# EAGLE schematic Mini12 (EAGLE 6.5.0)

## Sheet 1 of 3: Amplifier
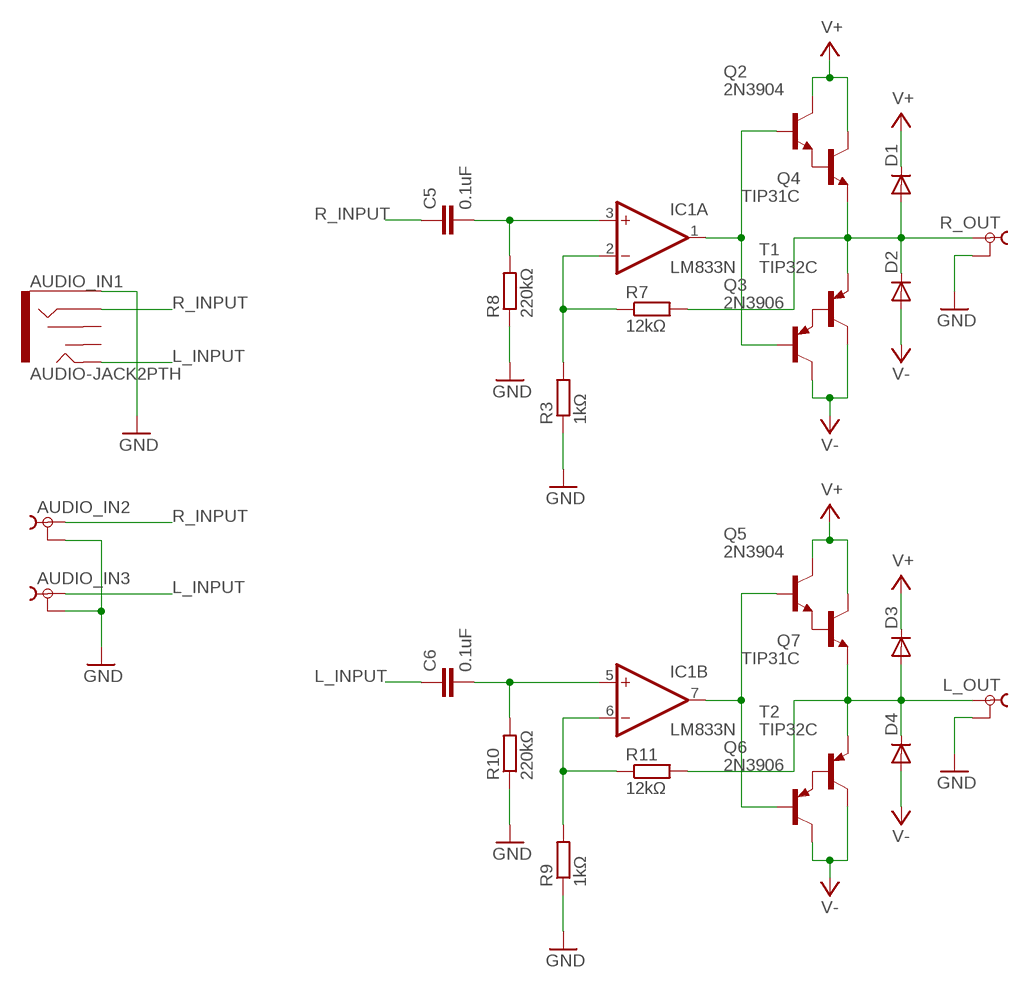
[diagram p0: schematic, sheet 1]

### Parts
AUDIO_IN1  AUDIO-JACK2PTH  [AUDIO-JACK]
AUDIO_IN2  TOBU3  [TOBU3]
AUDIO_IN3  TOBU3  [TOBU3]
C5  0.1uF  C-EU025-025X050  [C025-025X050]
C6  0.1uF  C-EU025-025X050  [C025-025X050]
D1  1N4148DO35-7  [DO35-7]
D2  1N4148DO35-7  [DO35-7]
D3  1N4148DO35-7  [DO35-7]
D4  1N4148DO35-7  [DO35-7]
IC1  LM833N  [DIL08]
L_OUT  TOBU3  [TOBU3]
Q2  2N3904  [TO92]
Q3  2N3906  [TO92]
Q4  TIP31C  [TO220]
Q5  2N3904  [TO92]
Q6  2N3906  [TO92]
Q7  TIP31C  [TO220]
R3  1kΩ  R-EU_0207/10  [0207/10]
R7  12kΩ  R-EU_0207/10  [0207/10]
R8  220kΩ  R-EU_0207/10  [0207/10]
R9  1kΩ  R-EU_0207/10  [0207/10]
R10  220kΩ  R-EU_0207/10  [0207/10]
R11  12kΩ  R-EU_0207/10  [0207/10]
R_OUT  TOBU3  [TOBU3]
T1  TIP32C  [TO220]
T2  TIP32C  [TO220]

### Nets
GND: AUDIO_IN1.SLEEVE AUDIO_IN2.2 AUDIO_IN2.2@1 AUDIO_IN2.2@2 AUDIO_IN3.2 AUDIO_IN3.2@1 AUDIO_IN3.2@2 L_OUT.2 L_OUT.2@1 L_OUT.2@2 R3.1 R8.1 R9.1 R10.1 R_OUT.2 R_OUT.2@1 R_OUT.2@2 ; also sheet 2,3
L_INPUT: AUDIO_IN1.TIP AUDIO_IN3.1 C6.1
N$2: IC1.2(A:-IN) R3.2 R7.1
N$3: C5.2 IC1.3(A:+IN) R8.2
N$5: IC1.6(B:-IN) R9.2 R11.1
N$6: C6.2 IC1.5(B:+IN) R10.2
N$24: Q2.3(E) Q4.1(B)
N$25: Q3.3(E) T1.1(B)
N$26: D1.A D2.C Q4.3(E) R7.2 R_OUT.1 T1.3(E)
N$27: IC1.1(A:OUT) Q2.2(B) Q3.2(B)
N$31: Q5.3(E) Q7.1(B)
N$32: Q6.3(E) T2.1(B)
N$33: D3.A D4.C L_OUT.1 Q7.3(E) R11.2 T2.3(E)
N$34: IC1.7(B:OUT) Q5.2(B) Q6.2(B)
R_INPUT: AUDIO_IN1.RING AUDIO_IN2.1 C5.1
V+: D1.C D3.C Q2.1(C) Q4.2(C) Q5.1(C) Q7.2(C) ; also sheet 2,3
V-: D2.A D4.A Q3.1(C) Q6.1(C) T1.2(C) T2.2(C) ; also sheet 2,3
Unconnected: AUDIO_IN1.RSH AUDIO_IN1.TSH

## Sheet 2 of 3: Power Supply
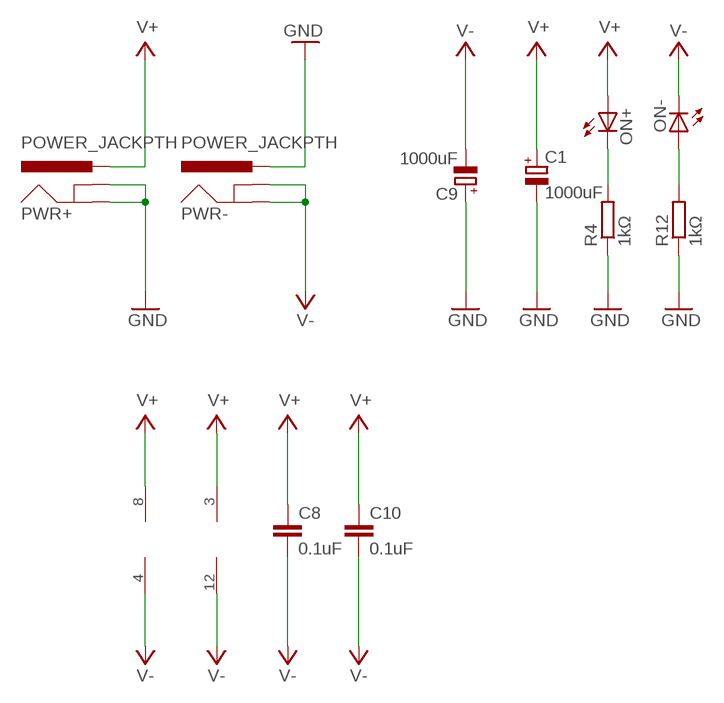
[diagram p1: schematic, sheet 2]

### Parts
C1  1000uF  CPOL-EUE2.5-6  [E2,5-6]
C8  0.1uF  C-EU025-025X050  [C025-025X050]
C9  1000uF  CPOL-EUE2.5-6  [E2,5-6]
C10  0.1uF  C-EU025-025X050  [C025-025X050]
IC2  LM339N  [DIL14]
ON+  LEDSQR2X5  [LED2X5]
ON-  LEDSQR2X5  [LED2X5]
PWR+  POWER_JACKPTH  [POWER_JACK_PTH]
PWR-  POWER_JACKPTH  [POWER_JACK_PTH]
R4  1kΩ  R-EU_0207/10  [0207/10]
R12  1kΩ  R-EU_0207/10  [0207/10]

### Nets
GND: C1.- C9.+ PWR+.GND PWR+.GNDBREAK PWR-.PWR R4.1 R12.1 ; also sheet 1,3
N$7: ON-.A R12.2
N$22: ON+.K(C) R4.2
V+: C1.+ C8.1 C10.1 IC1.8(P:V+) IC2.3(P:V+) ON+.A PWR+.PWR ; also sheet 1,3
V-: C8.2 C9.- C10.2 IC1.4(P:V-) IC2.12(P:GND) ON-.K(C) PWR-.GND PWR-.GNDBREAK ; also sheet 1,3

## Sheet 3 of 3: Clipping/Overload Detector
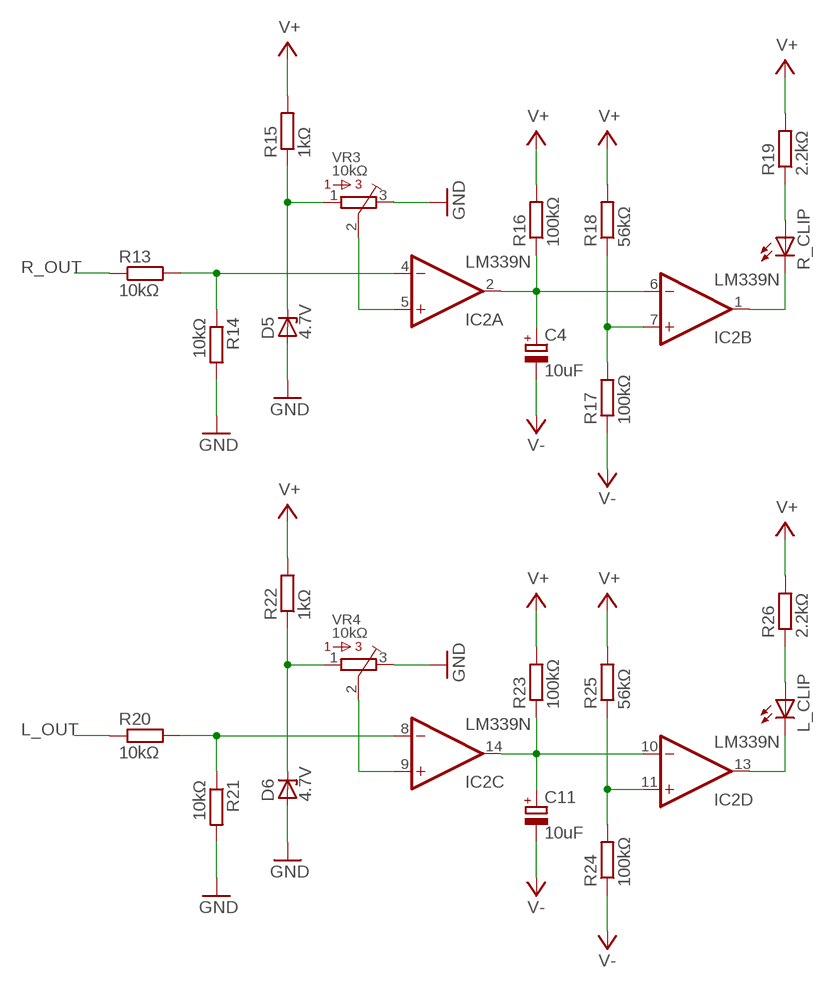
[diagram p2: schematic, sheet 3]

### Parts
C4  10uF  CPOL-EUE2.5-6  [E2,5-6]
C11  10uF  CPOL-EUE2.5-6  [E2,5-6]
D5  4.7V  ZENER-DIODEDO34-7  [DO34Z7]
D6  4.7V  ZENER-DIODEDO34-7  [DO34Z7]
L_CLIP  LED5MM  [LED5MM]
R13  10kΩ  R-EU_0207/10  [0207/10]
R14  10kΩ  R-EU_0207/10  [0207/10]
R15  1kΩ  R-EU_0207/10  [0207/10]
R16  100kΩ  R-EU_0207/10  [0207/10]
R17  100kΩ  R-EU_0207/10  [0207/10]
R18  56kΩ  R-EU_0207/10  [0207/10]
R19  2.2kΩ  R-EU_0207/10  [0207/10]
R20  10kΩ  R-EU_0207/10  [0207/10]
R21  10kΩ  R-EU_0207/10  [0207/10]
R22  1kΩ  R-EU_0207/10  [0207/10]
R23  100kΩ  R-EU_0207/10  [0207/10]
R24  100kΩ  R-EU_0207/10  [0207/10]
R25  56kΩ  R-EU_0207/10  [0207/10]
R26  2.2kΩ  R-EU_0207/10  [0207/10]
R_CLIP  LED5MM  [LED5MM]
VR3  10kΩ  3362U  [3362U]
VR4  10kΩ  3362U  [3362U]

### Nets
GND: D5.A D6.A R14.2 R21.2 VR3.3 VR4.3 ; also sheet 1,2
L_OUT: R20.1
N$9: IC2.4(A:-IN) R13.2 R14.1
N$10: IC2.5(A:+IN) VR3.2
N$11: D5.C R15.1 VR3.1
N$12: C4.+ IC2.2(A:OUT) IC2.6(B:-IN) R16.1
N$13: IC2.7(B:+IN) R17.2 R18.1
N$14: IC2.1(B:OUT) R_CLIP.K(C)
N$15: R19.1 R_CLIP.A
N$16: IC2.8(C:-IN) R20.2 R21.1
N$17: IC2.9(C:+IN) VR4.2
N$18: D6.C R22.1 VR4.1
N$19: C11.+ IC2.10(D:-IN) IC2.14(C:OUT) R23.1
N$20: IC2.11(D:+IN) R24.2 R25.1
N$21: IC2.13(D:OUT) L_CLIP.K(C)
N$23: L_CLIP.A R26.1
R_OUT: R13.1
V+: R15.2 R16.2 R18.2 R19.2 R22.2 R23.2 R25.2 R26.2 ; also sheet 1,2
V-: C4.- C11.- R17.1 R24.1 ; also sheet 1,2

## Library data of the parts
AUDIO_IN1 = SparkFun-Connectors:AUDIO-JACK2: Stereo audio jack with bypass switches.
AUDIO_IN2 AUDIO_IN3 L_OUT R_OUT = con-hirschmann:TOBU3: Female Cinch CONNECTOR ( RCA Jack ); MF: FARNELL; MPN: TOBU 3; OC_FARNELL: 592791; OC_NEWARK: 06WX5914
C1 C4 C9 C11 = rcl:CPOL-EU: POLARIZED CAPACITOR, European symbol
C5 C6 C8 C10 = rcl:C-EU: CAPACITOR, European symbol
D1-D4 = diode:1N4148: DIODE high speed (Philips)
D5 D6 = diode:ZENER-DIODE: Z-Diode
IC1 = linear:LM833: OP AMP
IC2 = linear:LM339: Low Power Low Offset Voltage Quad Comparators with open collector; LM139/LM239/LM339/LM2901/LM3302
L_CLIP R_CLIP = adafruit:LED: LED
ON+ ON- = led:LED: LED
PWR+ PWR- = SparkFun-Connectors:POWER_JACK: Power Jack This is the standard 5.5mm barrel jack for power. The PTH is the most common, proven, reliable, footprint. The Slot footprint only works if the mill layer is transmitted to the PCB fab house so be warned. Spark Fun Electronics SKU : PRT-00119 SMT: CONN-08106 Mating wall wart : TOL-00298 (and others)
Q2 Q5 = transistor-npn:2N3904: NPN Transistor
Q3 Q6 = transistor-pnp:2N3906: PNP Transistor
Q4 Q7 = transistor-npn:TIP31C*: NPN Transistor
R3 R4 R7-R26 = rcl:R-EU_: RESISTOR, European symbol
T1 T2 = transistor:TIP32: PNP Transistor Medium Power Linear Switching Applications Source: http://onsemi.com
VR3 VR4 = bourns:3362: 3362 Series 1/4" Square Trimmer